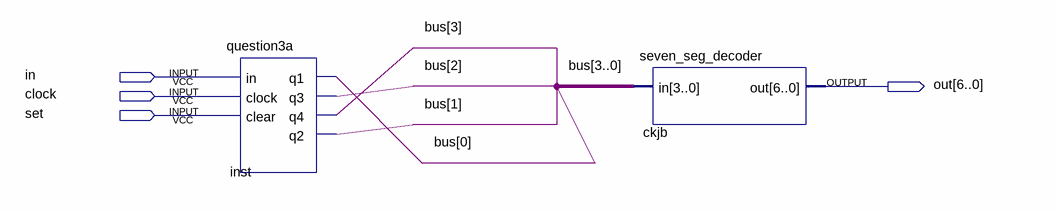
[diagram p0: schematic sheet]
// Quartus schematic threeatest.bdf as structural Verilog: 2 symbols, 4 pins
module threeatest (
  input  in,
  input  clock,
  input  set,
  output [6:0] out
);

  wire [3:0] bus;

  question3a inst (.in(in), .clock(clock), .clear(set), .q1(bus[0]), .q3(bus[2]), .q4(bus[3]), .q2(bus[1]));
  seven_seg_decoder ckjb (.in(bus), .out(out));
endmodule
